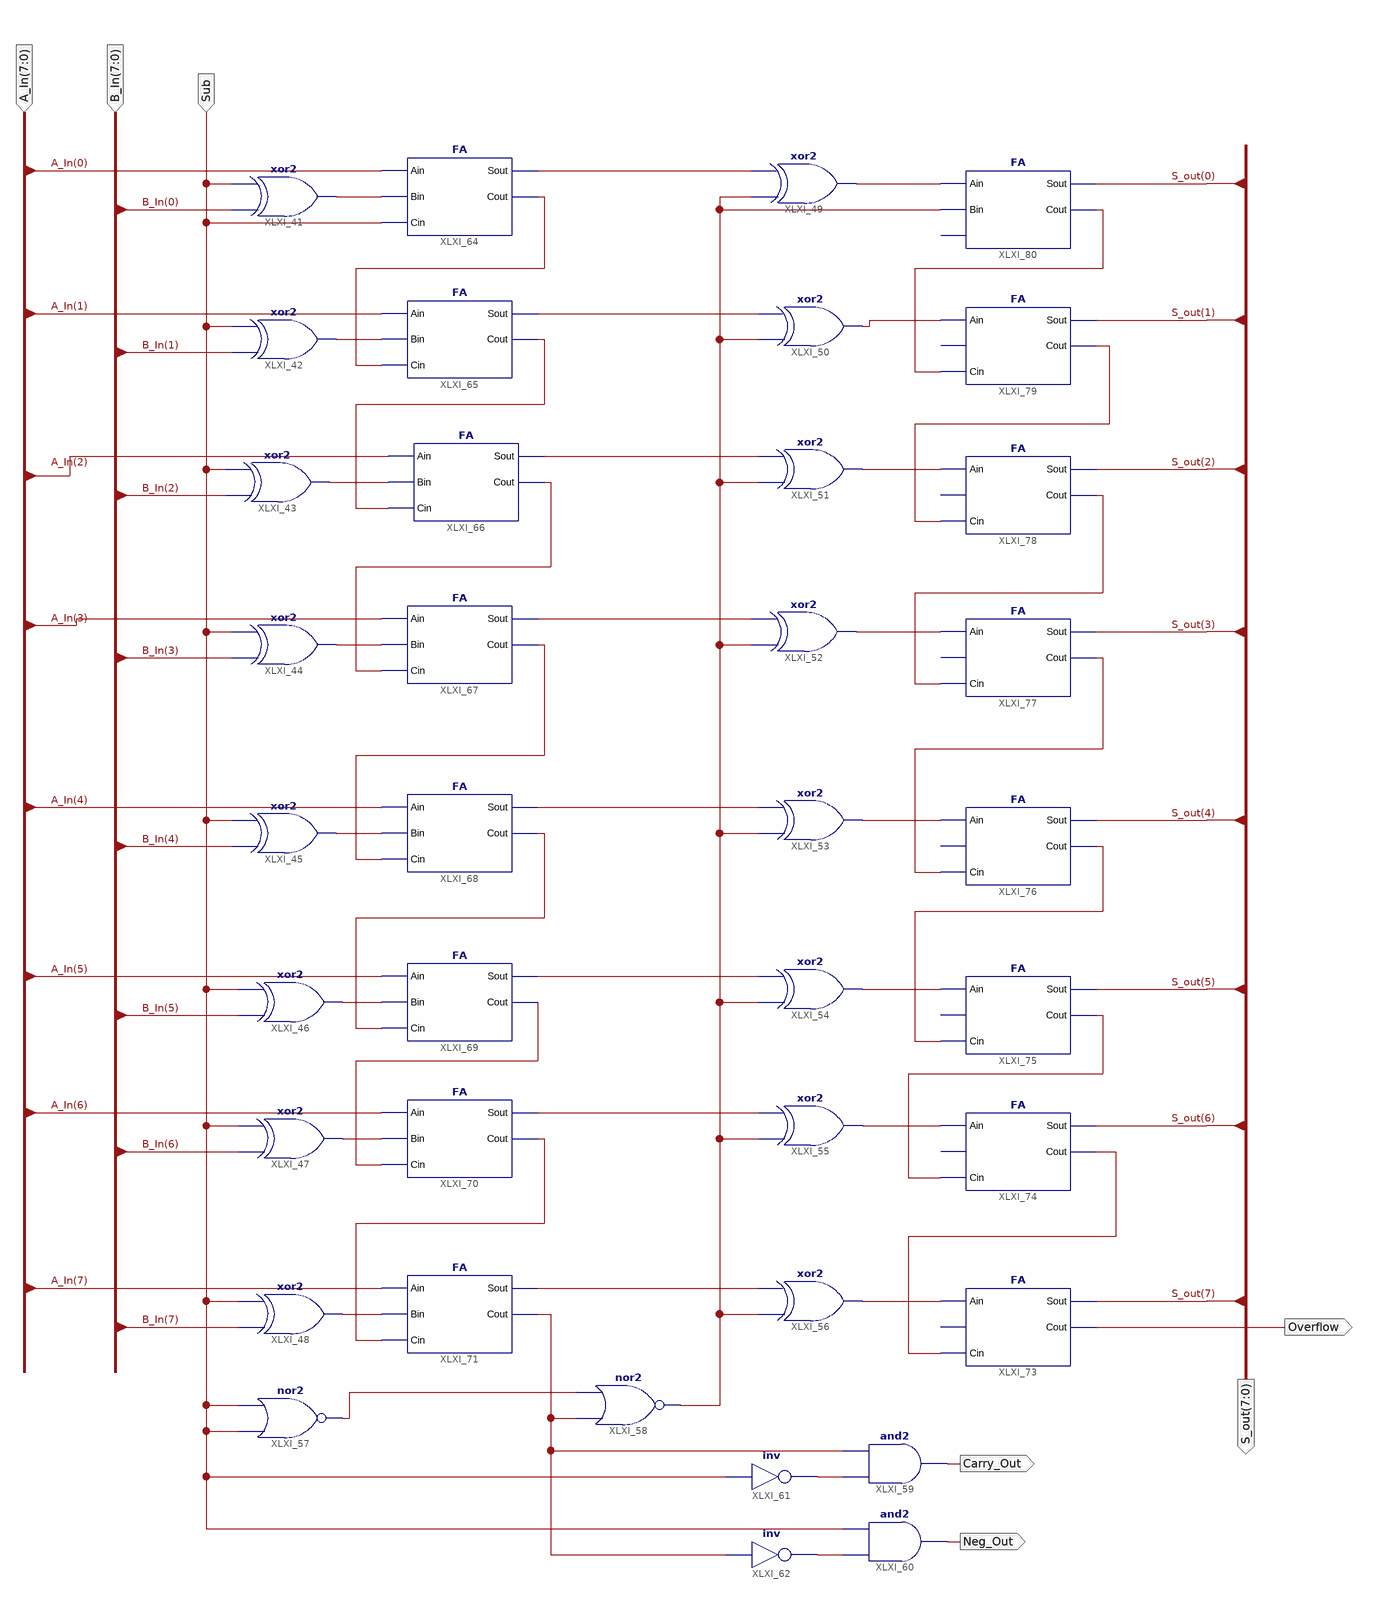
[diagram p0: schematic sheet 1]
// Xilinx ISE schematic FA_8Bit.sch (spartan3e) as structural Verilog: 38 symbols, 7 ports
module FA_8Bit (
  input  [7:0] B_In,
  input  [7:0] A_In,
  input  Sub,
  output [7:0] S_out,
  output Overflow,
  output Neg_Out,
  output Carry_Out
);

  wire XLXN_14, XLXN_15, XLXN_16, XLXN_17, XLXN_18, XLXN_19, XLXN_20, XLXN_21, XLXN_35, XLXN_38, XLXN_39,
       XLXN_41, XLXN_42, XLXN_43, XLXN_44, XLXN_45, XLXN_47, XLXN_48, XLXN_49, XLXN_50, XLXN_51, XLXN_52,
       XLXN_54, XLXN_56, XLXN_57, XLXN_59, XLXN_60, XLXN_61, XLXN_65, XLXN_66, XLXN_67, XLXN_69, XLXN_70,
       XLXN_71, XLXN_89, XLXN_90, XLXN_92, XLXN_94, XLXN_96, XLXN_97, XLXN_99, XLXN_102, XLXN_181;

  xor XLXI_41 (XLXN_14, B_In[0], Sub);
  xor XLXI_45 (XLXN_18, B_In[4], Sub);
  xor XLXI_46 (XLXN_19, B_In[5], Sub);
  xor XLXI_47 (XLXN_20, B_In[6], Sub);
  xor XLXI_48 (XLXN_21, B_In[7], Sub);
  xor XLXI_42 (XLXN_15, B_In[1], Sub);
  xor XLXI_49 (XLXN_42, XLXN_94, XLXN_51);
  xor XLXI_50 (XLXN_43, XLXN_94, XLXN_52);
  xor XLXI_51 (XLXN_44, XLXN_94, XLXN_54);
  xor XLXI_52 (XLXN_45, XLXN_94, XLXN_56);
  xor XLXI_53 (XLXN_47, XLXN_94, XLXN_57);
  xor XLXI_54 (XLXN_48, XLXN_94, XLXN_59);
  xor XLXI_55 (XLXN_49, XLXN_94, XLXN_60);
  xor XLXI_56 (XLXN_50, XLXN_94, XLXN_61);
  xor XLXI_43 (XLXN_16, B_In[2], Sub);
  xor XLXI_44 (XLXN_17, B_In[3], Sub);
  nor XLXI_57 (XLXN_92, Sub, Sub);
  nor XLXI_58 (XLXN_94, XLXN_181, XLXN_92);
  not XLXI_62 (XLXN_90, XLXN_181);
  not XLXI_61 (XLXN_89, Sub);
  and XLXI_60 (Neg_Out, XLXN_90, Sub);
  and XLXI_59 (Carry_Out, XLXN_89, XLXN_181);
  FA XLXI_64 (.Bin(XLXN_14), .Ain(A_In[0]), .Cin(Sub), .Cout(XLXN_35), .Sout(XLXN_51));
  FA XLXI_65 (.Bin(XLXN_15), .Ain(A_In[1]), .Cin(XLXN_35), .Cout(XLXN_96), .Sout(XLXN_52));
  FA XLXI_66 (.Bin(XLXN_16), .Ain(A_In[2]), .Cin(XLXN_96), .Cout(XLXN_97), .Sout(XLXN_54));
  FA XLXI_67 (.Bin(XLXN_17), .Ain(A_In[3]), .Cin(XLXN_97), .Cout(XLXN_38), .Sout(XLXN_56));
  FA XLXI_68 (.Bin(XLXN_18), .Ain(A_In[4]), .Cin(XLXN_38), .Cout(XLXN_39), .Sout(XLXN_57));
  FA XLXI_69 (.Bin(XLXN_19), .Ain(A_In[5]), .Cin(XLXN_39), .Cout(XLXN_99), .Sout(XLXN_59));
  FA XLXI_70 (.Bin(XLXN_20), .Ain(A_In[6]), .Cin(XLXN_99), .Cout(XLXN_41), .Sout(XLXN_60));
  FA XLXI_71 (.Bin(XLXN_21), .Ain(A_In[7]), .Cin(XLXN_41), .Cout(XLXN_181), .Sout(XLXN_61));
  FA XLXI_73 (.Ain(XLXN_50), .Cin(XLXN_71), .Cout(Overflow), .Sout(S_out[7]));  // open: Bin
  FA XLXI_74 (.Ain(XLXN_49), .Cin(XLXN_70), .Cout(XLXN_71), .Sout(S_out[6]));  // open: Bin
  FA XLXI_75 (.Ain(XLXN_48), .Cin(XLXN_69), .Cout(XLXN_70), .Sout(S_out[5]));  // open: Bin
  FA XLXI_76 (.Ain(XLXN_47), .Cin(XLXN_102), .Cout(XLXN_69), .Sout(S_out[4]));  // open: Bin
  FA XLXI_77 (.Ain(XLXN_45), .Cin(XLXN_67), .Cout(XLXN_102), .Sout(S_out[3]));  // open: Bin
  FA XLXI_78 (.Ain(XLXN_44), .Cin(XLXN_66), .Cout(XLXN_67), .Sout(S_out[2]));  // open: Bin
  FA XLXI_79 (.Ain(XLXN_43), .Cin(XLXN_65), .Cout(XLXN_66), .Sout(S_out[1]));  // open: Bin
  FA XLXI_80 (.Bin(XLXN_94), .Ain(XLXN_42), .Cout(XLXN_65), .Sout(S_out[0]));  // open: Cin
endmodule
